# Altium project A80R_EQ_Repro.PrjPcb
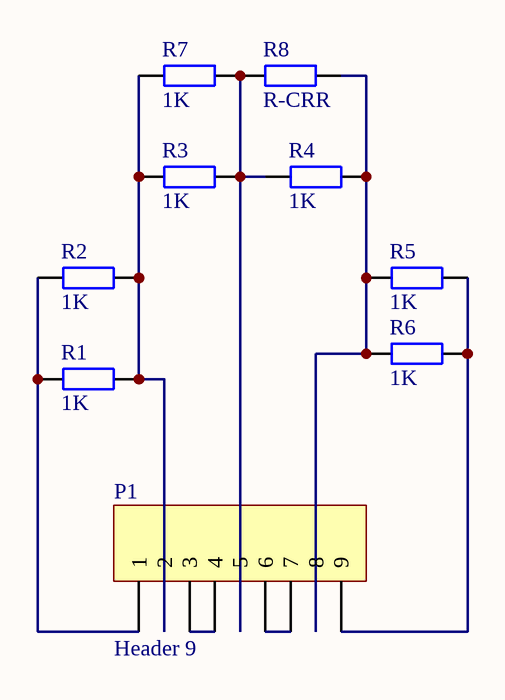
[diagram p0: A80R_EQ_Repro.SchDoc]
1 sheet, 9 parts. Net scope: global (net labels, ports and power ports of the same name join across sheets).
Board file: A80R_EQ_Repro.PcbDoc

## Sheet A80R_EQ_Repro.SchDoc
size A4

### Parts
P1  Header 9  [HDR1X9]
R1  1K  [RS 1/4W]
R2  1K  [RS 1/4W]
R3  1K  [RS 1/4W]
R4  1K  [RS 1/4W]
R5  1K  [RS 1/4W]
R6  1K  [RS 1/4W]
R7  1K  [RS 1/2W-L]
R8  R-CRR  [RS 1/2W-L]

### Nets
NetP1_1: P1.1 R1.1 R2.1
NetP1_2: P1.2 R1.2 R2.2 R3.1 R7.1
NetP1_3: P1.3 P1.4
NetP1_5: P1.5 R3.2 R4.1 R7.2 R8.1
NetP1_6: P1.6 P1.7
NetP1_8: P1.8 R4.2 R5.1 R6.1 R8.2
NetP1_9: P1.9 R5.2 R6.2

### Library data of the parts
P1 = Header 9: Header, 9-Pin; LatestRevisionDate: 17-Jul-2002; LatestRevisionNote: Re-released for DXP Platform.; Publisher: Altium Limited
R1-R8 = R-CRR: 直插色环电阻; BOM名称: 色环电阻; 版权归属: 源创客; 学习资源: www.ooocke.com